# EAGLE design Suits_Board (EAGLE 6.1)
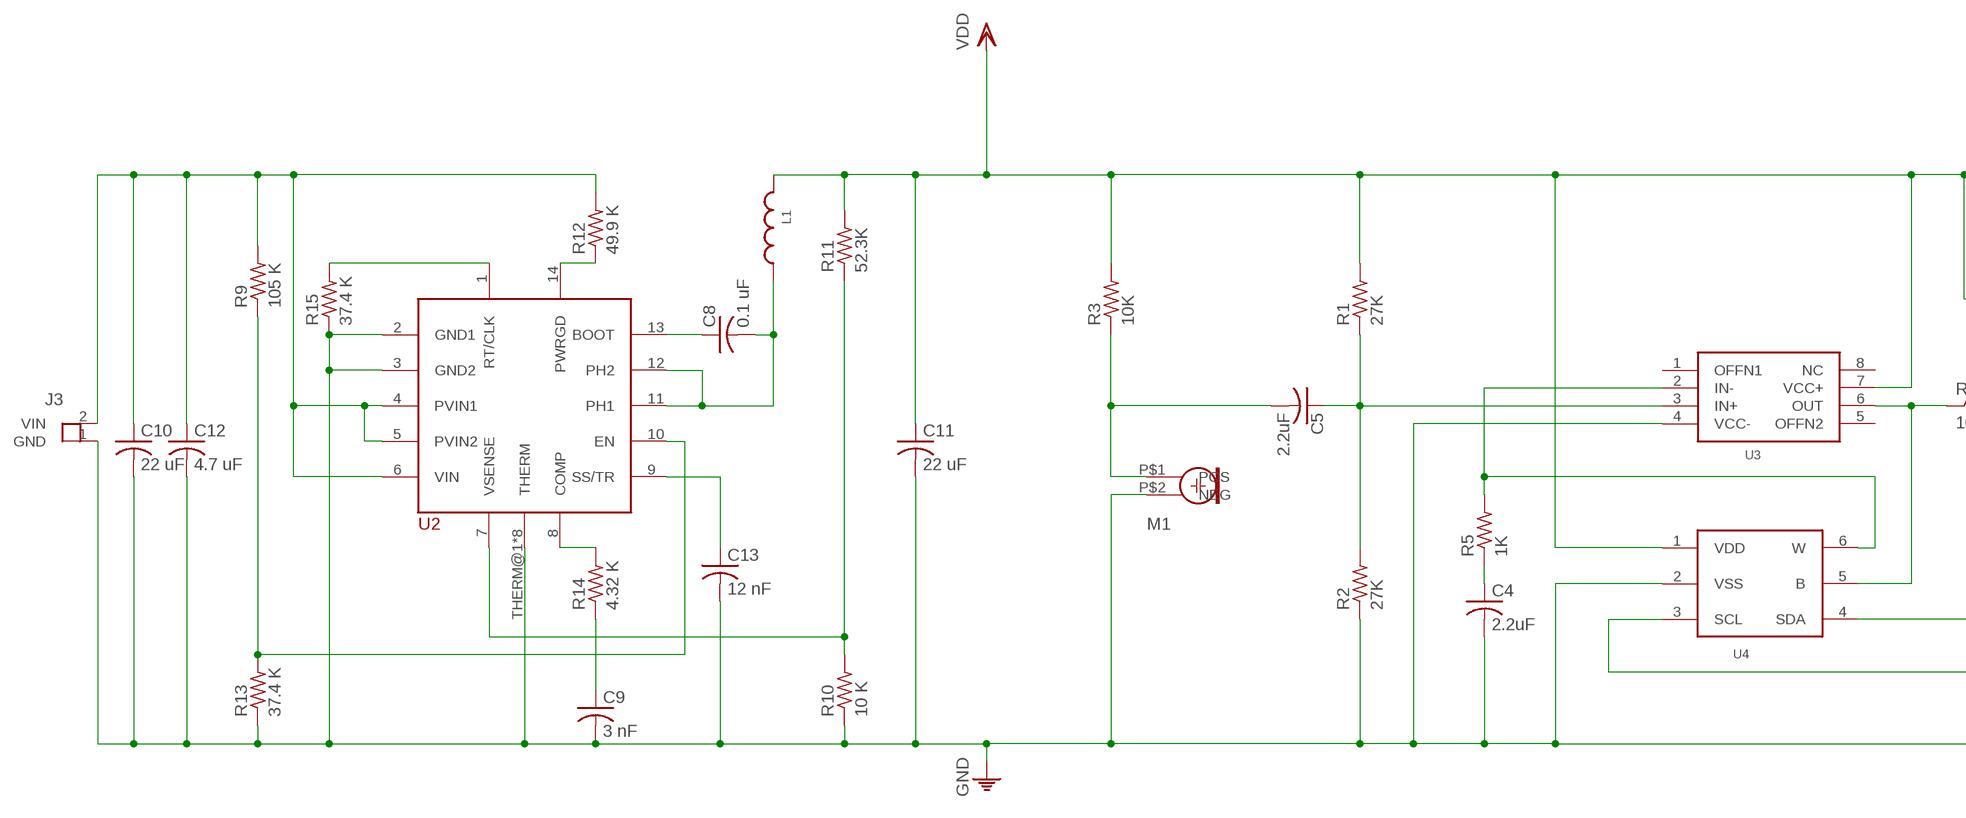
[diagram p0: schematic, sheet 1, part 1 of 2]
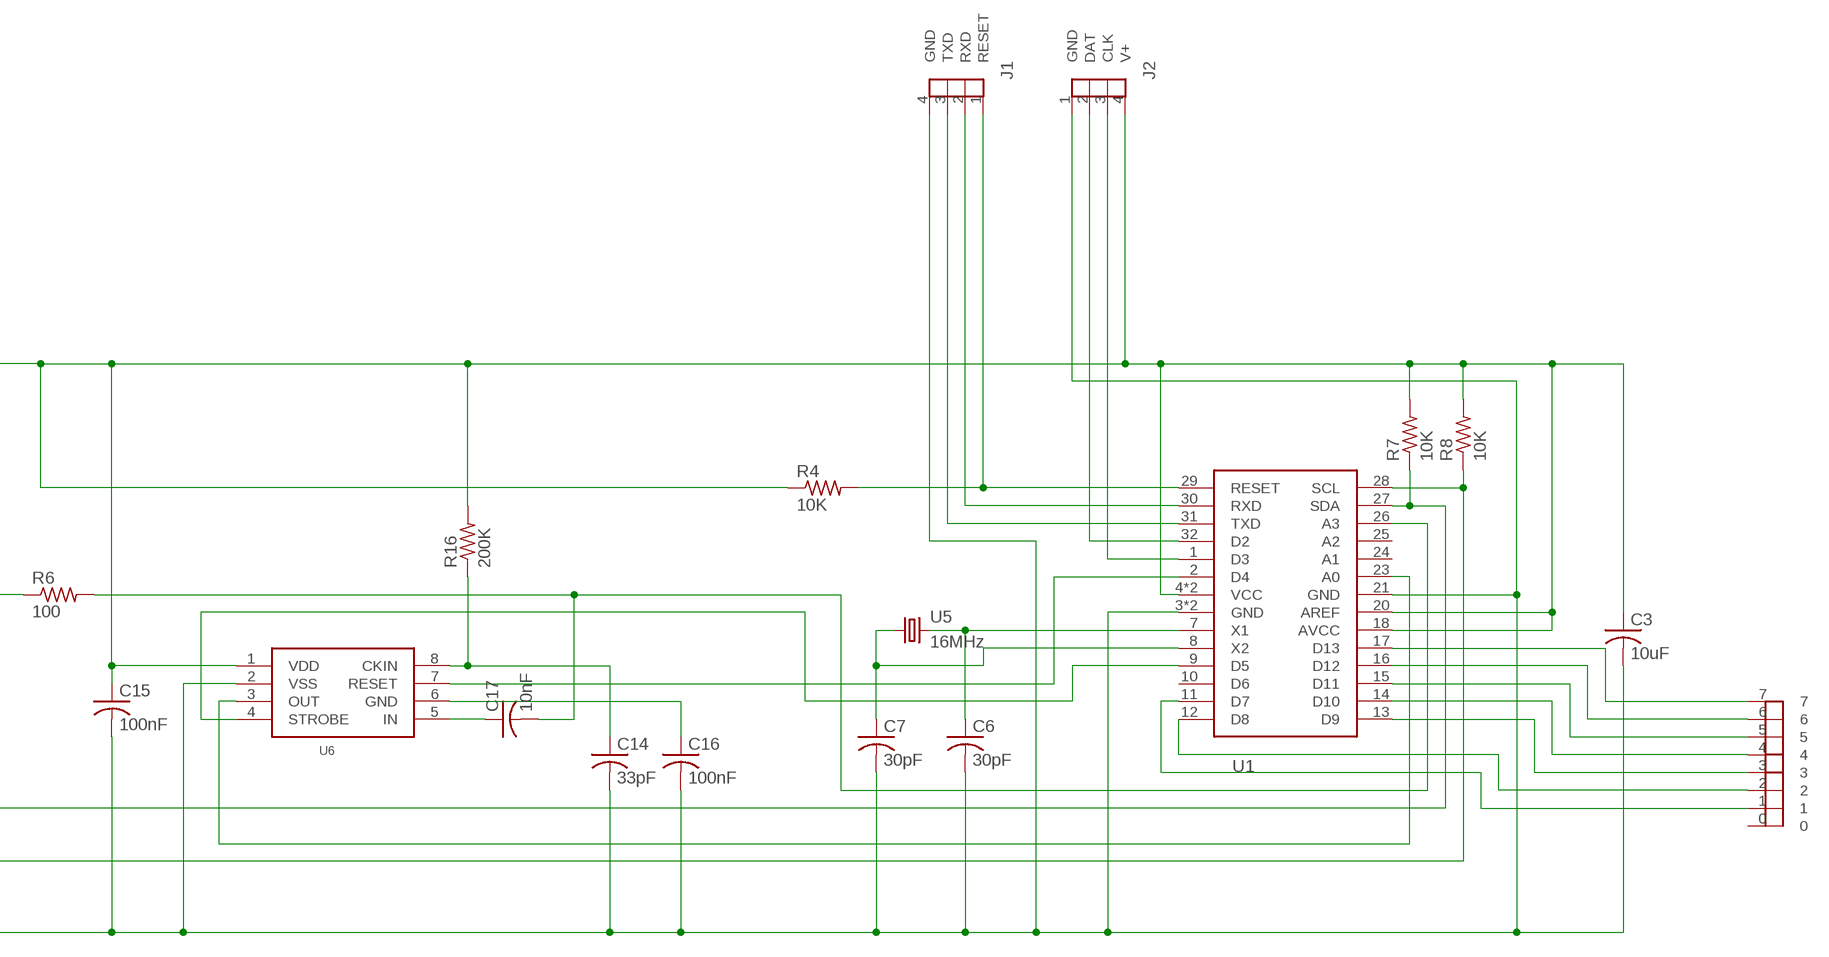
[diagram p1: schematic, sheet 1, part 2 of 2]

## Parts
C3  10uF  CAP0805  [0805]
C4  2.2uF  CAP0603  [0603]
C5  2.2uF  CAP0603  [0603]
C6  30pF  CAP0603  [0603]
C7  30pF  CAP0603  [0603]
C8  0.1 uF  CAP0805  [0805]
C9  3 nF  CAP0805  [0805]
C10  22 uF  CAP1210  [1210]
C11  22 uF  CAP1210  [1210]
C12  4.7 uF  CAP0805  [0805]
C13  12 nF  CAP0402  [0402]
C14  33pF  CAP0402  [0402]
C15  100nF  CAP0805  [0805]
C16  100nF  CAP0805  [0805]
C17  10nF  CAP0402  [0402]
J1  PRGMCONN  [4CONN]
J2  LEDCONN  [4CONN]
J3  PWRCONN  [2CONN]
L1  VLF10045T  [VLF10045]
M1  ELEC_MIC  [ELEC_MIC]
R1  27K  RESISTOR  [0603]
R2  27K  RESISTOR  [0603]
R3  10K  RESISTOR  [0603]
R4  10K  RESISTOR  [0603]
R5  1K  RESISTOR  [0603]
R6  100  RESISTOR  [0603]
R7  10K  RESISTOR  [0603]
R8  10K  RESISTOR  [0603]
R9  105 K  R0402  [0402]
R10  10 K  R0402  [0402]
R11  52.3K  R0402  [0402]
R12  49.9 K  R0402  [0402]
R13  37.4 K  R0402  [0402]
R14  4.32 K  R0402  [0402]
R15  37.4 K  R0402  [0402]
R16  200K  RESISTOR  [0603]
U1  ATMEGA328P  [TQFP32-08]
U2  TPS54620  [14-VFQFN]
U3  TL071  [8-SOIC]
U4  MCP4017  [SOT-363]
U5  16MHz  CRYSTAL  [HC49/US]
U6  FFT IC  MSGEQ7  [DIP8]
U$1  KEYPAD  [KEYPAD]

## Nets
GND: C3.A1 C4.2 C6.2 C7.2 C9.A1 C10.P$2 C11.P$2 C12.A1 C13.P$2 C14.P$2 C15.A1 C16.A1 J1.4(GND) J2.1(GND) J3.1(GND) M1.P$2(NEG) R2.1 R10.P$1 R13.P$1 R15.P$1 U1.3(GND) U1.5(GND) U1.21(GND) U2.2(GND1) U2.3(GND2) U2.THERM@1(THERM) U2.THERM@2(THERM) U2.THERM@3(THERM) U2.THERM@4(THERM) U2.THERM@5(THERM) U2.THERM@6(THERM) U2.THERM@7(THERM) U2.THERM@8(THERM) U3.4(VCC-) U4.2(VSS) U6.2(VSS)
J1: J1.1(RESET) R4.2 U1.29(RESET)
N$1: C14.P$1 R16.1 U6.8(CKIN)
N$2: C16.A U6.6(GND)
N$3: C5.2 M1.P$1(POS) R3.1
N$4: R7.1 U1.27(SDA) U4.4(SDA)
N$5: C5.1 R1.1 R2.2 U3.3(IN+)
N$6: C17.P$2 R6.2 U1.26(A3)
N$7: C6.1 U1.7(X1) U5.P$2
N$8: R14.P$2 U2.8(COMP)
N$9: J1.2(RXD) U1.30(RXD)
N$10: C4.1 R5.1
N$11: R5.2 U3.2(IN-) U4.6(W)
N$12: J1.3(TXD) U1.31(TXD)
N$13: R6.1 U3.6(OUT) U4.5(B)
N$14: U1.9(D5) U6.4(STROBE)
N$15: J2.2(DAT) U1.32(D2)
N$16: R9.P$1 R13.P$2 U2.10(EN)
N$17: J2.3(CLK) U1.1(D3)
N$18: C9.A R14.P$1
N$19: R8.1 U1.28(SCL) U4.3(SCL)
N$20: C13.P$1 U2.9(SS/TR)
N$21: R15.P$2 U2.1(RT/CLK)
N$22: R12.P$1 U2.14(PWRGD)
N$23: C8.A1 L1.P$1 U2.11(PH1) U2.12(PH2)
N$24: R10.P$2 R11.P$1 U2.7(VSENSE)
N$25: C8.A U2.13(BOOT)
N$26: C17.P$1 U6.5(IN)
N$30: U1.23(A0) U6.3(OUT)
N$38: U1.17(D13) U$1.7
N$39: U1.15(D11) U$1.5
N$41: U1.16(D12) U$1.6
N$42: U1.14(D10) U$1.4
N$43: U1.13(D9) U$1.3
N$44: U1.12(D8) U$1.2
N$45: U1.11(D7) U$1.1
N$46: U1.2(D4) U6.7(RESET)
NAME\RIP: C7.1 U1.8(X2) U5.P$1
VDD: C3.A C11.P$1 C15.A J2.4(V+) L1.P$2 R1.2 R3.2 R4.1 R7.2 R8.2 R11.P$2 R16.2 U1.4(VCC) U1.6(VCC) U1.18(AVCC) U1.20(AREF) U3.7(VCC+) U4.1(VDD) U6.1(VDD)
VIN: C10.P$1 C12.A J3.2(VIN) R9.P$2 R12.P$2 U2.4(PVIN1) U2.5(PVIN2) U2.6(VIN)
Unconnected: U1.10(D6) U1.24(A1) U1.25(A2) U3.1(OFFN1) U3.5(OFFN2) U3.8(NC) U$1.0

## Library data of the parts
C3 C8 C9 C12 C15 C16 = lightsuits:CAP0805
C4-C7 = lightsuits:CAP0603
C10 C11 = lightsuits:CAP1210
C13 C14 C17 = lightsuits:CAP0402
J1 = lightsuits:PRGMCONN
J2 = lightsuits:LEDCONN
J3 = lightsuits:PWRCONN
L1 = lightsuits:VLF10045T
M1 = lightsuits:ELEC_MIC
R1-R8 R16 = lightsuits:RESISTOR
R9-R15 = lightsuits:R0402
U1 = lightsuits:ATMEGA328P
U2 = lightsuits:TPS54620
U3 = lightsuits:TL071
U4 = lightsuits:MCP4017
U5 = lightsuits:CRYSTAL
U6 = lightsuits:MSGEQ7
U$1 = lightsuits:KEYPAD

## Board
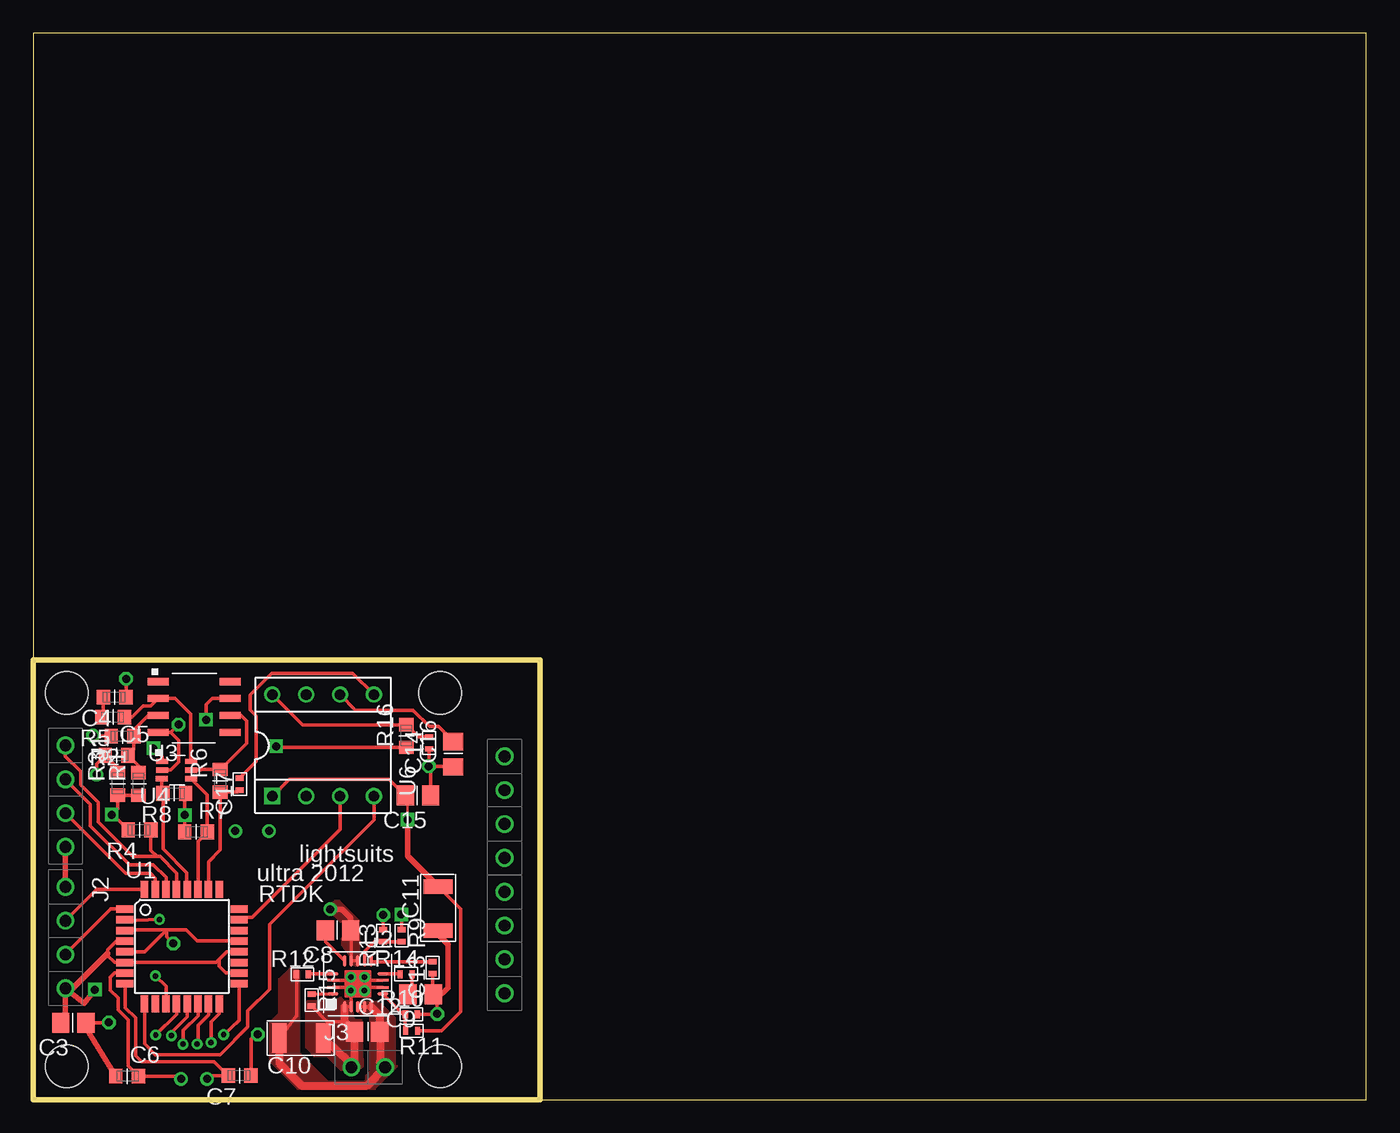
[diagram p2: board, top side]
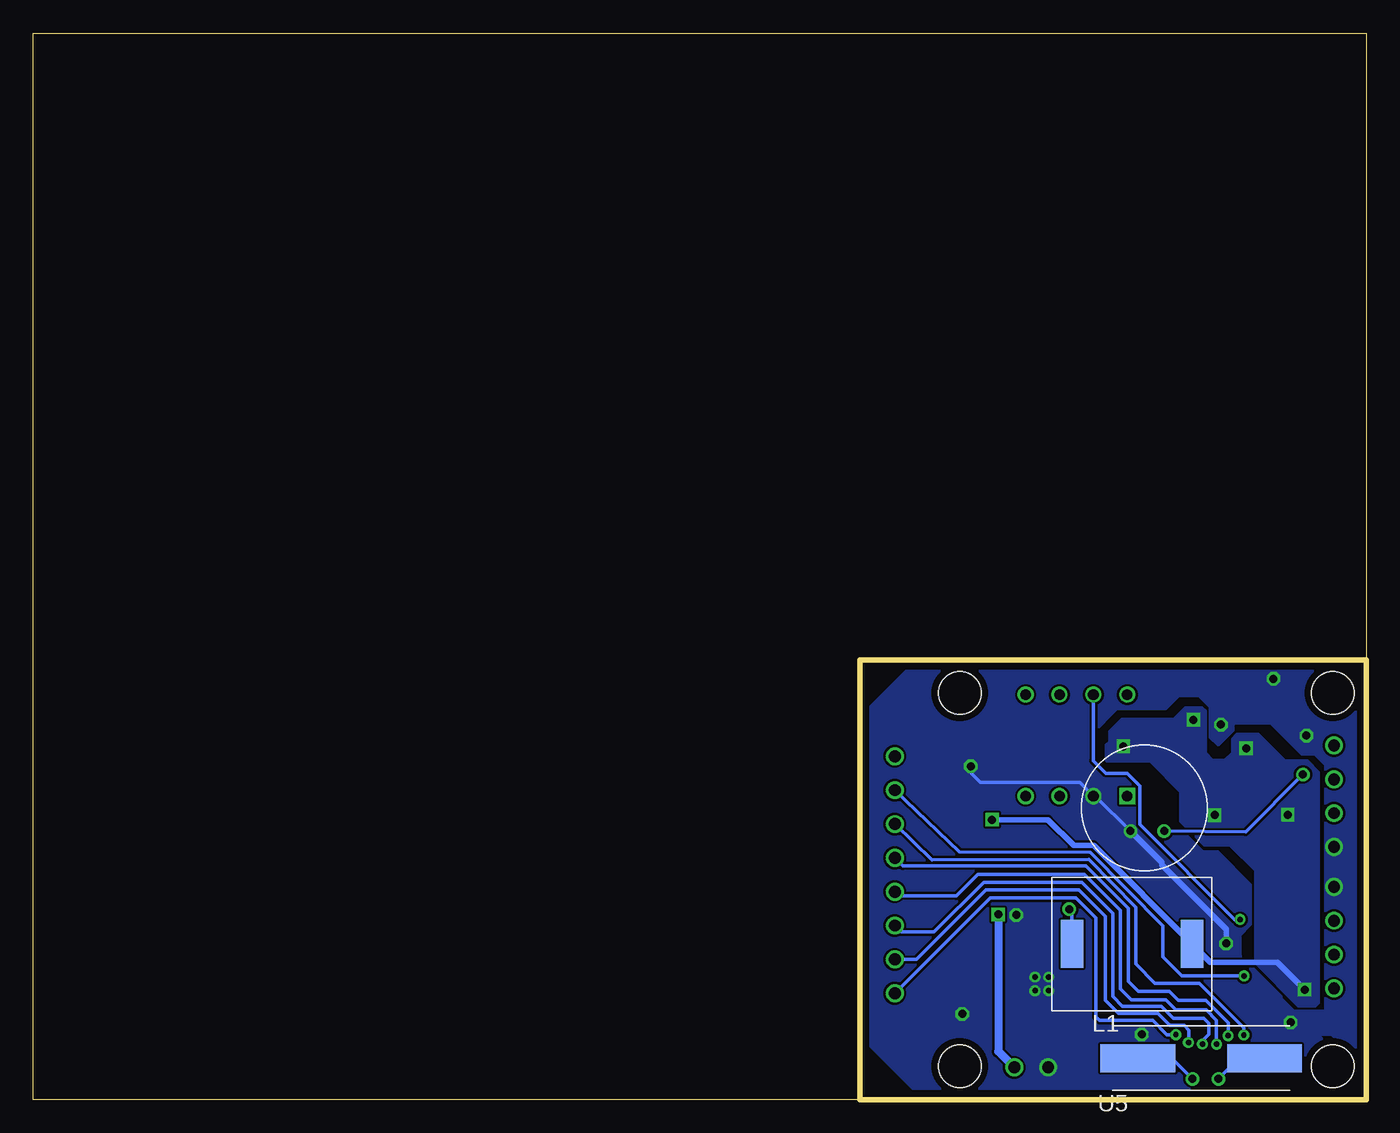
[diagram p3: board, bottom side, seen from below]

Size 100 x 80 mm. Coordinates in mm from the lower left corner, seen from the top.
Outline: 38,0 100,0 100,80 0,80 0,33
Outline: 38,0 0,0 0,33
Outline: 38,0 38,33 0,33
Copper layers (1*16): Top 0.0178mm / dielectric 59mil / Bottom 0.0178mm
Design rules: minimum track width 7mil, minimum drill 16mil, track to track 7mil, track to pad 7mil, pad to pad 7mil, via to via 7mil, smd to smd 7mil, copper to edge 20mil, drill to drill 16mil, minimum pad ring 8mil, minimum via ring 8mil, stop-mask expansion 3mil, vias tented up to drill 0mil, thermal gap 10mil
Holes 3.2 mm at 2.5,2.5 30.5,2.5 30.5,30.5 2.5,30.5

### Footprints (pad centres in the part's own frame; a part is rotated, then mirrored left to right if it is on the bottom)
0805 = smd 1.3 x 1.5: A 0,0; A1 1.9,0
0603 = smd 1 x 1.1: 1 -0.8,0; 2 0.9,0
1210 = smd 1.1 x 2.2: P$1 0,0; P$2 3.3,0
0402 = smd 0.4 x 0.6: P$1 0,0; P$2 0.9,0
4CONN = drill 0.89: 1 -3.81,0; 2 -1.27,0; 3 1.27,0; 4 3.81,0
2CONN = drill 0.89: 1 -3.81,0; 2 -1.27,0
VLF10045 = smd 1.7 x 3.6: P$1 0,0; P$2 9,0
ELEC_MIC = drill 0.6: P$1 0,2.54; P$2 0,0
TQFP32-08 = smd 1.27 x 0.559: 1 -4.293,2.8; 2 -4.293,2; 3 -4.293,1.2; 4 -4.293,0.4; 5 -4.293,-0.4; 6 -4.293,-1.2; 7 -4.293,-2; 8 -4.293,-2.8; 17 4.293,-2.8; 18 4.293,-2; 19 4.293,-1.2; 20 4.293,-0.4; 21 4.293,0.4; 22 4.293,1.2; 23 4.293,2; 24 4.293,2.8 | smd 0.559 x 1.27: 9 -2.8,-4.293; 10 -2,-4.293; 11 -1.2,-4.293; 12 -0.4,-4.293; 13 0.4,-4.293; 14 1.2,-4.293; 15 2,-4.293; 16 2.8,-4.293; 25 2.8,4.293; 26 2,4.293; 27 1.2,4.293; 28 0.4,4.293; 29 -0.4,4.293; 30 -1.2,4.293; 31 -2,4.293; 32 -2.8,4.293
14-VFQFN = smd 0.85 x 0.28: 1 1.875,0.75; 7 -1.875,0.75; 8 -1.875,-0.75; 14 1.875,-0.75 | smd 0.28 x 0.85: 2 1,1.725; 3 0.5,1.725; 4 0,1.725; 5 -0.5,1.725; 6 -1,1.725; 9 -1,-1.725; 10 -0.5,-1.725; 11 0,-1.725; 12 0.5,-1.725; 13 1,-1.725 | smd 0.9 x 0.2: THERM@1 1.85,-0.275; THERM@2 1.85,0.275; THERM@3 -1.85,0.275; THERM@4 -1.85,-0.275 | drill 0.406: THERM@5 -0.512,0.512; THERM@6 -0.512,-0.512; THERM@7 0.512,-0.512; THERM@8 0.512,0.512
8-SOIC = smd 1.6 x 0.55: 1 0,0; 2 0,-1.27; 3 0,-2.54; 4 0,-3.81; 5 5.4,-3.81; 6 5.4,-2.54; 7 5.4,-1.27; 8 5.4,0
SOT-363 = smd 0.9 x 0.4: 1 0,0; 2 0,-0.65; 3 -0.02,-1.3; 4 2.2,-1.3; 5 2.2,-0.65; 6 2.2,0
HC49/US = smd 5.6 x 2.1: P$1 0,0; P$2 9.5,0
DIP8 = drill 0.8 square: 1 0,0 | drill 0.8: 2 0,-2.54; 3 0,-5.08; 4 0,-7.62; 5 7.62,-7.62; 6 7.62,-5.08; 7 7.62,-2.54; 8 7.62,0
KEYPAD = drill 0.89: 0 -8.89,0; 1 -6.35,0; 2 -3.81,0; 3 -1.27,0; 4 1.27,0; 5 3.81,0; 6 6.35,0; 7 8.89,0

### Placement (x,y rotation side)
C3  2.05,5.76 0 top
C4  6.05,30.19 0 top
C5  6.29,25.82 180 top
C6  7.08,1.76 180 top
C7  15.43,1.79 0 top
C8  21.9,12.71 0 top
C9  28.11,7.88 0 top
C10  18.45,4.61 0 top
C11  30.37,15.98 270 top
C12  26,5.09 180 top
C13  29.95,10.35 270 top
C14  29.69,27.21 270 top
C15  27.91,22.82 0 top
C16  31.5,26.86 270 top
C17  15.49,24.12 270 top
J1  2.41,22.76 270 top
J2  2.41,12.15 270 top
J3  27.67,2.41 0 top
L1  22.07,11.67 0 bottom
M1  17.69,20.14 270 bottom
R1  7.89,23.72 270 top
R2  6.64,27.27 0 top
R3  6.33,23.73 270 top
R4  7.92,20.23 0 top
R5  5.94,28.7 0 top
R6  14.02,23.97 270 top
R7  12.25,20.08 180 top
R8  10.53,22.97 0 top
R9  27.63,11.84 90 top
R10  28.81,6.39 180 top
R11  27.93,5.16 0 top
R12  20.64,9.39 180 top
R13  26.25,12.74 270 top
R14  28.42,9.41 180 top
R15  20.88,7.02 90 top
R16  27.99,27.32 270 top
U1  11.15,11.49 0 top
U2  24.34,8.68 180 top
U3  9.37,31.36 0 top
U4  9.65,25.37 0 top
U5  17.13,3.11 0 bottom
U6  17.93,22.76 90 top
U$1  35.36,16.86 270 top

### Tracks (layer width: path | path; a pad name or v marks a point on that pad's centre or on a via)
GND  (via drill 0.6)
  Top 0.254: U2.2 U2.3 23.83,6.97 U2.THERM@8 | U1.21 12.31,11.89 11.45,12.75 10.01,12.75 | 10.01,12.75 6.92,12.75 U1.3 | U1.5 8.35,11.09 10.01,12.75 | C4.2 v6.96,31.56 | C16.A1 31.46,25 v29.67,25 | v29.67,25 29.69,25.02 C14.P$2 | v29.67,25 29.81,24.86 C15.A1 | U2.THERM@8 U2.THERM@5 25.09,8.4 U2.THERM@3 | 23.34,5.85 22.05,5.85 R15.P$1 | R10.P$1 30.28,6.39 v30.31,6.42 30.31,7.58 C9.A1 29.95,7.94 C13.P$2 | R13.P$1 v26.25,13.84 | C3.A1 5.63,5.76 v5.66,5.79 | 10.01,12.75 10.01,12.21 v10.51,11.71 | R2.1 4.53,27.27 v4.49,27.31 | v10.9,28.14 10.31,27.55 | 10.31,27.55 U3.4 | U4.2 10.31,24.72 10.92,25.33 10.92,26.94 10.31,27.55 | U2.THERM@1 23.59,8.96 U2.THERM@7 | U2.THERM@4 25.09,8.96 U2.THERM@6 | U2.THERM@2 23.59,8.4 U2.THERM@8 | v16.84,4.88 16.33,4.55 C7.2
  Top 0.406: J2.1 J1.4 | C3.A1 3.95,5.35 C6.2 | 30.31,7.58 31.13,8.4 31.13,11.63 30.37,12.39 C11.P$2
  Top 0.61: U2.2 23.34,5.85 C12.A1 24.1,2.65 J3.1 23.86,2.69 C10.P$2
  Bottom 0.254: v29.67,25 29.67,24.5 28.95,23.78 21.49,23.78 U6.2 20.31,22.76 M1.P$2
  Bottom 0.406: v10.51,11.71 10.51,12.78 15.35,17.62 15.35,17.8 M1.P$2
  pour Bottom (no thermals): -0.04,1.42 -0.04,29.22 3.78,33.04 33.6,33.04 38.23,28.41 38.23,5.07 33.47,0.31 1.47,0.31 1.47,2.67 6.41,7.61 6.41,7.75 9.48,10.82 9.48,12.33 8.68,13.13 8.68,16.12 11.13,18.57 12.24,18.57 15.09,21.42 15.09,22.71 17.36,24.98 19.58,24.98 20.56,25.96 20.56,27.47 18.69,29.34 15.04,29.34 14.06,30.32 12.56,30.32 11.68,29.44 11.68,27.18 11.09,26.59 10,27.68 10,28.09 9.83,28.26 7.15,28.26 4.83,25.94 3.87,25.94 3.04,25.11 3.04,5.35 0.95,3.26 0.95,1.39 0.92,1.42 -0.03,1.42
  pour Bottom: 1.13,6.58 1.17,6.62 6.58,6.62 6.35,6.39 6.35,4.91 1.13,4.91 1.12,4.92 1.12,6.62
  pour Top (no thermals): 23.2,2.09 22.03,3.26 21.12,3.26 20.46,3.92 20.46,7.27 20.57,7.38 23.91,7.38 23.94,7.35 23.94,6.18 24.16,5.96 24.64,5.93 24.59,5.89 24.7,2.51 23.98,1.98 22.9,2.56
  pour Top (no thermals): 22.91,7.34 22.91,7.55 23.64,8.28 24.06,7.86 24.06,7.63 23.64,7.21 23.03,7.21 22.9,7.34
J1
  Top 0.254: 9.28,18.23 7.46,18.23 4.85,20.84 4.85,22.28 3.54,23.59 3.54,24.63 2.41,25.76 J1.1 | 9.28,18.23 9.5,18.23 10.75,16.98 U1.29 | R4.2 8.82,18.69 9.28,18.23
N$1
  Top 0.254: U6.8 20.19,28.12 R16.1 28.9,27.21 C14.P$1
N$2
  Top 0.254: U6.6 24.18,29.21 28.51,29.21 29.72,28 30.39,28 31.5,26.89 C16.A
N$3  (via drill 0.6)
  Top 0.254: R3.1 6.33,24.88 C5.2 4.74,25.17 v4.74,24.39
  Bottom 0.254: M1.P$1 9.05,20.08 v4.74,24.39
N$4
  Top 0.254: 12.39,15.82 U1.27 12.35,19.38 R7.1 13.05,22.87 U4.4
N$5
  Top 0.254: R1.1 7.89,25.02 C5.1 7.54,26.27 R2.2 7.54,27.74 8.62,28.82 U3.3
N$6
  Top 0.254: U1.26 13.14,15.79 13.14,17.85 14.02,18.73 R6.2 15.34,23.07 C17.P$2
N$7  (via drill 0.6)
  Top 0.254: U1.7 6.1,9.49 5.78,9.17 5.78,8.21 6.36,7.63 6.36,6.74 7.11,5.99 7.11,2.53 C6.1 10.87,1.76 v11.09,1.54
  Bottom 0.254: v11.09,1.54 9.52,3.11 U5.P$2
N$8
  Top 0.254: U2.8 27.5,9.43 R14.P$2
N$9
  Top 0.254: J1.2 4.28,22.16 4.28,20.55 7.22,17.61 9.01,17.61 9.95,16.67 U1.30
N$10
  Top 0.254: C4.1 5.25,28.81 R5.1
N$11
  Top 0.254: U4.6 11.82,25.4 11.82,28.92 10.65,30.09 U3.2 8.8,29.52 8.23,29.52 7.41,28.7 R5.2
N$12
  Top 0.254: J1.3 6.94,16.96 8.8,16.96 9.15,16.61 U1.31
N$13
  Top 0.254: 14.75,28.84 U3.6 15.59,28.82 16.02,28.39 16.02,26.73 14.06,24.77 R6.1 12.58,24.77 12.56,24.75 11.88,24.75 U4.5 11.82,24.75
N$14
  Top 0.254: U1.9 8.35,4.18 9.16,3.37 14.01,3.37 16.09,5.45 16.09,6.64 17.73,8.28 17.73,13.14 25.56,20.97 25.55,20.98 U6.4
N$15
  Top 0.254: J2.2 4.77,15.78 U1.32
N$16
  Top 0.254: U2.10 24.84,11.11 25.57,11.84 R13.P$2 R9.P$1
N$17
  Top 0.254: J2.3 5.82,14.29 U1.1
N$18
  Top 0.254: R14.P$1 28.42,8.19 C9.A
N$19
  Top 0.254: U4.3 9.63,23.05 R8.1 9.73,18.79 11.51,17.01 11.51,15.82 U1.28
N$20
  Top 0.254: C13.P$1 25.39,10.35 U2.9
N$21
  Top 0.254: R15.P$2 22.45,7.91 U2.1
N$22
  Top 0.254: U2.14 20.68,9.43 R12.P$1
N$23  (via drill 0.6)
  Top 0.254: U2.11 U2.12 23.84,12.26 C8.A1
  Top 0.406: v22.28,14.28 23.16,14.28 23.81,13.63 C8.A1
  Bottom 0.254: L1.P$1 22.07,14.07 v22.28,14.28
  pour Top (no thermals): 24.43,10.54 24.43,12.34 24.2,12.57 23.66,12.57 23.18,12.09 23.18,11.6 23.88,10.66 23.93,10.13 24.27,10.03
  pour Top (no thermals): 23.18,13.38 23.01,13.38 22.06,14.33 22.07,14.33 22.64,14.9 22.95,14.9 24.45,13.4 23.7,13.33 23.44,13.37 23.2,13.52
N$24
  Top 0.254: U2.7 27.75,6.39 R10.P$2 27.91,5.18 R11.P$1
N$25
  Top 0.254: C8.A 21.92,11.82 U2.13
N$26
  Top 0.254: U6.5 23.96,31.97 17.89,31.97 16.26,30.34 16.26,29.24 16.73,28.77 16.73,25.36 C17.P$1
N$30
  Top 0.254: U6.3 23.01,20.26 16.41,13.66 15.61,13.66 U1.23
N$38  (via drill 0.41)
  Top 0.254: v14.28,4.86 15.44,5.95 U1.17
  Bottom 0.254: U$1.7 28.18,15.15 21.79,15.15 20.28,13.64 20.28,6.2 20.01,5.93 16.01,5.93 14.94,4.86 v14.28,4.86
N$39  (via drill 0.41)
  Top 0.254: U1.15 13.15,6.34 12.37,5.56 12.37,4.19 v12.29,4.16
  Bottom 0.254: U$1.5 34.88,12.57 32.44,12.57 28.7,16.31 21.35,16.31 19,13.96 19,7.73 18.28,7.01 15.36,7.01 14.46,6.11 12.19,6.11 11.8,5.72 11.8,4.88 12.29,4.39 v12.29,4.16
N$41  (via drill 0.41)
  Top 0.254: U1.16 13.95,6.43 13.34,5.82 v13.34,4.27
  Bottom 0.254: U$1.6 33.74,10.51 28.53,15.72 21.54,15.72 19.56,13.74 19.56,7.43 18.61,6.48 15.63,6.48 14.73,5.58 13.66,5.58 13.29,5.21 13.29,4.32 v13.34,4.27
N$42  (via drill 0.41)
  Top 0.254: U1.14 12.35,6.3 11.23,5.18 v11.23,4.15
  Bottom 0.254: v11.23,4.15 11.23,5.95 12.01,6.73 14.27,6.73 15.04,7.5 17.63,7.5 18.45,8.32 18.45,14.2 21.15,16.9 29.14,16.9 30.76,15.28 35.05,15.28 U$1.4
N$43  (via drill 0.41)
  Top 0.254: U1.13 11.55,6.2 10.36,5.01 v10.36,4.79
  Bottom 0.254: v10.36,4.79 10.36,5.76 12.04,7.44 14.09,7.44 14.76,8.11 17.09,8.11 17.85,8.87 17.85,14.33 21.05,17.53 34.76,17.53 U$1.3
N$44  (via drill 0.41)
  Top 0.254: U1.12 10.75,6.41 v9.18,4.84
  Bottom 0.254: v9.18,4.84 9.18,5.38 12.51,8.71 15.84,8.71 17.3,10.17 17.3,14.42 20.8,18.01 32.59,17.99 U$1.2
N$45  (via drill 0.41)
  Top 0.254: U1.11 9.95,8.48 v9.16,9.27
  Bottom 0.254: v9.16,9.27 13.82,9.27 15.26,10.71 15.26,13.02 20.71,18.55 30.51,18.58 U$1.1
N$46  (via drill 0.41)
  Top 0.254: 6.9,13.53 U1.2 6.93,13.42 v9.46,13.51
  Bottom 0.254: U6.7 20.47,25.42 19.52,24.47 17.91,24.47 16.98,23.54 16.98,20.63 9.77,13.42 v9.46,13.51
NAME\RIP  (via drill 0.6)
  Top 0.254: U1.8 6.91,8.64 6.91,6.88 7.67,6.12 7.67,3.3 8.12,2.85 13.57,2.85 C7.1 13.27,1.79 v13.03,1.55
  Bottom 0.254: U5.P$1 14.59,3.11 v13.03,1.55
VDD  (via drill 0.6)
  Top 0.2: C15.A 28.07,22.82 v28.07,20.99
  Top 0.254: R8.2 11.36,22.9 v11.36,21.35 v11.35,21.34 R7.2 | U1.20 14.51,11.09 13.95,10.53 | 13.95,10.53 13.95,10.01 13.93,9.99 14.43,9.49 U1.18 | U1.4 6.24,11.89 5.59,11.24 5.59,10.96 5.59,10.8 6.09,10.3 6.85,10.3 U1.6 12.38,10.29 13.72,10.3 13.95,10.53 | R4.1 5.99,21.36 v5.88,21.36 6.33,21.81 R3.2 R1.2 | U4.1 9.65,25.71 v9,26.36 | R11.P$2 30.63,5.16 32.05,6.58 32.05,14.3 C11.P$1 | R16.2 18.31,26.42 v18.22,26.51 | v12.96,28.5 12.96,29.63 13.43,30.1 U3.7 | C15.A 26.71,24.02 19.2,24.02 U6.1
  Top 0.406: J2.4 2.41,6.12 C3.A | J2.4 2.97,8.34 5.59,10.96 | C11.P$1 28.07,18.28 v28.07,20.99 | v4.61,8.24 3.81,7.21 J2.4
  Bottom 0.406: v28.07,20.99 23.88,20.99 21.93,19.08 20.44,19.08 L1.P$2 11.7,10.29 6.67,10.29 v4.61,8.24
  pour Bottom: 19.49,26.59 19.23,26.85 19.23,27.63 18.34,28.52 14.44,28.52 13.58,29.38 12.32,29.38 12.08,29.14 12.08,25.99 11.53,25.44 10.59,25.44 10.01,26.02 10.01,27.07 9.7,27.38 8.09,27.38 6.1,25.39 4.43,25.39 3.59,24.55 3.59,22.36 3.59,7.27 3.81,7.05 5.08,7.05 8.3,10.27 8.3,17.18 10.23,19.11 12.13,19.11 13.89,20.87 13.89,23.1 16.18,25.39 19.44,25.39 19.5,25.45 19.5,26.59 19.5,26.6 19.49,26.6
VIN  (via drill 0.6)
  Top 0.254: U2.6 U2.5 U2.4 | R12.P$2 19.74,6.27 C10.P$1 | R9.P$2 27.63,13.88 v27.6,13.88
  Top 0.61: U2.6 26,6.29 C12.A 26,2.81 J3.2 25.03,1.04 20.14,1.04 18.45,2.73 C10.P$1
  Bottom 0.61: v27.6,13.88 27.6,3.61 J3.2
  pour Top (no thermals): 27.26,2.48 27.1,2.64 27.1,6.15 25.92,7.33 24.53,7.33 24.38,7.18 24.38,6.63 24.59,6.42 25.01,6.42 25.3,6.13 25.3,2.12 24.97,1.79 24.97,1.48 24.82,1.33 22.47,1.33 22.1,1.33 19.93,3.5 19.93,9.61 19.68,9.86 19.29,9.86 18.45,9.02 18.45,6.46 17.78,5.79 17.78,2.87 19.84,0.81 25.61,0.81 27.28,2.48

### Text on the board
tPlace: lightsuits | ultra 2012 | RTDK